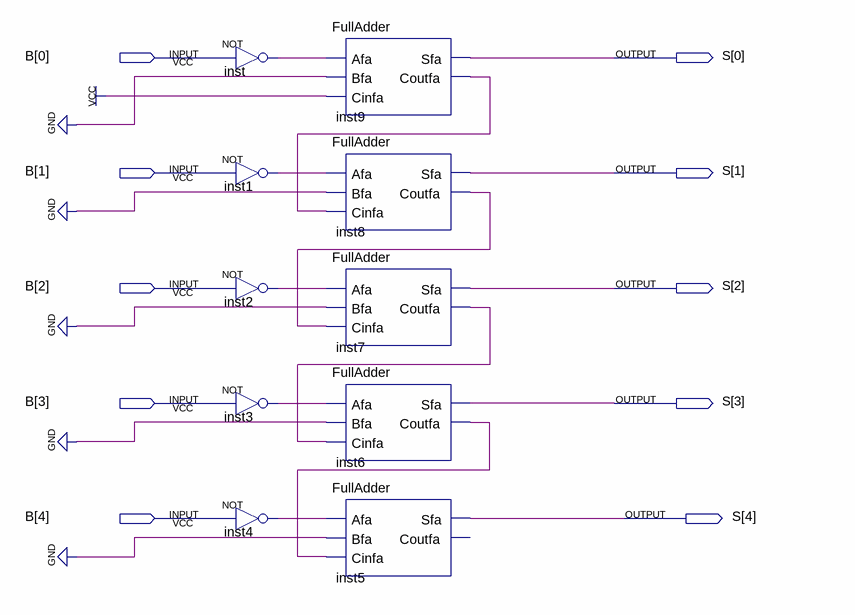
[diagram p0: schematic sheet]
// Quartus schematic BTwosComplement.bdf as structural Verilog: 10 symbols, 10 pins
module BTwosComplement (
  input  [4:0] B,
  output [4:0] S
);

  wire inst1_out, inst2_out, inst3_out, inst4_out, inst6_coutfa, inst7_coutfa, inst8_coutfa, inst9_coutfa,
       inst_out;

  not inst (inst_out, B[0]);
  not inst1 (inst1_out, B[1]);
  not inst2 (inst2_out, B[2]);
  not inst3 (inst3_out, B[3]);
  not inst4 (inst4_out, B[4]);
  FullAdder inst9 (.Afa(inst_out), .Bfa(1'b0), .Cinfa(1'b1), .Sfa(S[0]), .Coutfa(inst9_coutfa));
  FullAdder inst8 (.Afa(inst1_out), .Bfa(1'b0), .Cinfa(inst9_coutfa), .Sfa(S[1]), .Coutfa(inst8_coutfa));
  FullAdder inst7 (.Afa(inst2_out), .Bfa(1'b0), .Cinfa(inst8_coutfa), .Sfa(S[2]), .Coutfa(inst7_coutfa));
  FullAdder inst6 (.Afa(inst3_out), .Bfa(1'b0), .Cinfa(inst7_coutfa), .Sfa(S[3]), .Coutfa(inst6_coutfa));
  FullAdder inst5 (.Afa(inst4_out), .Bfa(1'b0), .Cinfa(inst6_coutfa), .Sfa(S[4]));  // open: Coutfa
endmodule
